# EAGLE design board_up (EAGLE 5.10)
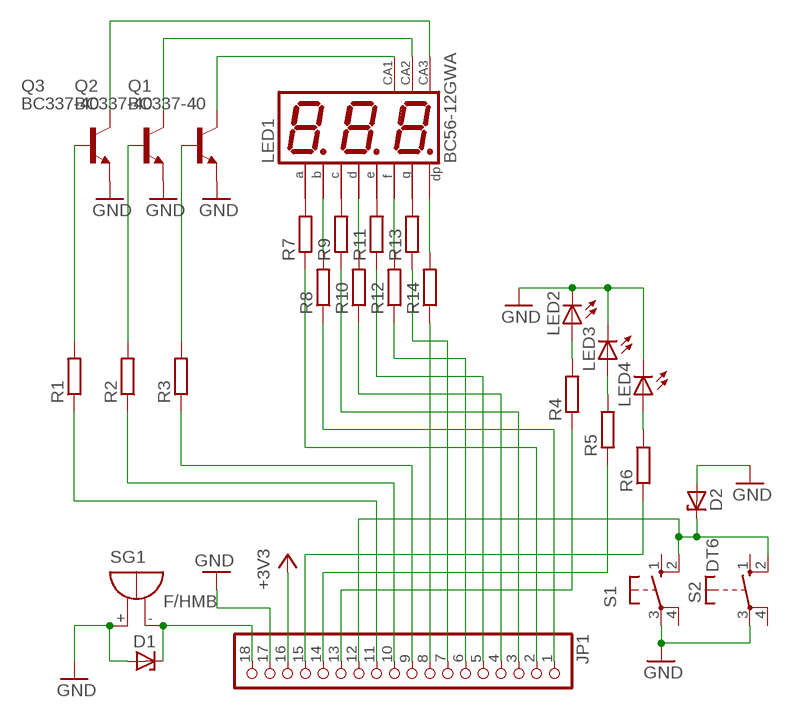
[diagram p0: schematic, sheet 1]

## Parts
D1  ZENER-DIODESMB  [SMB]
D2  ZENER-DIODESMB  [SMB]
JP1  PINHD-1X18  [1X18]
LED1  BC56-12GWA  [BX56-12]
LED2  LED3MM  [LED3MM]
LED3  LED3MM  [LED3MM]
LED4  LED3MM  [LED3MM]
Q1  BC337-40  [TO92]
Q2  BC337-40  [TO92]
Q3  BC337-40  [TO92]
R1  R-EU_R0805  [R0805]
R2  R-EU_R0805  [R0805]
R3  R-EU_R0805  [R0805]
R4  R-EU_R0805  [R0805]
R5  R-EU_R0805  [R0805]
R6  R-EU_R0805  [R0805]
R7  R-EU_R0805  [R0805]
R8  R-EU_R0805  [R0805]
R9  R-EU_R0805  [R0805]
R10  R-EU_R0805  [R0805]
R11  R-EU_R0805  [R0805]
R12  R-EU_R0805  [R0805]
R13  R-EU_R0805  [R0805]
R14  R-EU_R0805  [R0805]
S1  10-XX  [B3F-10XX]
S2  DT6  [DT6]
SG1  F/HMB  [F/HMB]

## Nets
+3V3: JP1.16
GND: D1.A D2.A JP1.17 LED2.K(C) LED3.K(C) LED4.K(C) Q1.1(E) Q2.1(E) Q3.1(E) S1.3(P) S2.3(P) SG1.+
N$1: Q2.2(B) R2.2
N$2: Q1.2(B) R3.2
N$3: Q3.2(B) R1.2
N$4: LED1.12(CA) Q1.3(C)
N$5: LED1.9(CA) Q2.3(C)
N$6: LED1.8(CA) Q3.3(C)
N$7: JP1.2 R7.1
N$8: JP1.1 R8.1
N$9: JP1.3 R9.1
N$10: JP1.4 R10.1
N$11: JP1.5 R11.1
N$12: JP1.6 R12.1
N$13: JP1.7 R13.1
N$14: LED1.11(A) R7.2
N$15: JP1.9 R3.1
N$16: JP1.10 R2.1
N$17: JP1.11 R1.1
N$18: D1.C JP1.18 SG1.-
N$19: D2.C JP1.12 S1.2(S1) S2.2(S)
N$20: LED1.7(B) R8.2
N$21: LED2.A R4.2
N$22: LED3.A R5.2
N$23: LED4.A R6.2
N$24: LED1.4(C) R9.2
N$25: JP1.13 R4.1
N$26: JP1.14 R5.1
N$27: JP1.15 R6.1
N$28: LED1.2(D) R10.2
N$29: LED1.1(E) R11.2
N$30: LED1.10(F) R12.2
N$31: LED1.5(G) R13.2
N$32: LED1.3(DP) R14.2
N$33: JP1.8 R14.1
Unconnected: S1.1(S) S1.4(P1) S2.1(S) S2.4(P)

## Library data of the parts
D1 D2 = diode:ZENER-DIODE: Z-Diode
JP1 = pinhead:PINHD-1X18: PIN HEADER
LED1 = display-kingbright:B?56-12*WA: 14.22mm (0.56INCH) THREE DIGIT NUMERIC DISPLAY Source: http://www.kingbright.com .. BA56-11EWA(Ver1189474895.pdf
LED2-LED4 = led:LED: LED OSRAM: - CHIPLED LG R971, LG N971, LY N971, LG Q971, LY Q971, LO R971, LY R971 LH N974, LH R974 LS Q976, LO Q976, LY Q976 LO Q996 - Hyper CHIPLED LW Q18S LB Q993, LB Q99A, LB R99A - SideLED LS A670, LO A670, LY A670, LG A670, LP A670 LB A673, LV A673, LT A673, LW A673 LH A674 LY A675 LS A676, LA A676, LO A676, LY A676, LW A676 LS A679, LY A679, LG A679 - Hyper Micro SIDELED® LS Y876, LA Y876, LO Y876, LY Y876 LT Y87S - SmartLED LW L88C, LW L88S LB L89C, LB L89S, LG L890 LS L89K, LO L89K, LY L89K LS L896, LA L896, LO L896, LY L896 - TOPLED LS T670, LO T670, LY T670, LG T670, LP T670 LSG T670, LSP T670, LSY T670, LOP T670, LYG T670 LG T671, LOG T671, LSG T671 LB T673, LV T673, LT T673, LW T673 LH T674 LS T676, LA T676, LO T676, LY T676, LB T676, LH T676, LSB T676, LW T676 LB T67C, LV T67C, LT T67C, LS T67K, LO T67K, LY T67K, LW E67C LS E67B, LA E67B, LO E67B, LY E67B, LB E67C, LV E67C, LT E67C LW T67C LS T679, LY T679, LG T679 LS T770, LO T770, LY T770, LG T770, LP T770 LB T773, LV T773, LT T773, LW T773 LH T774 LS E675, LA E675, LY E675, LS T675 LS T776, LA T776, LO T776, LY T776, LB T776 LHGB T686 LT T68C, LB T68C - Hyper Mini TOPLED® LB M676 - Mini TOPLED Santana® LG M470 LS M47K, LO M47K, LY M47K Source: http://www.osram.convergy.de LUXEON: - LUMILED® LXK2-PW12-R00, LXK2-PW12-S00, LXK2-PW14-U00, LXK2-PW14-V00 LXK2-PM12-R00, LXK2-PM12-S00, LXK2-PM14-U00 LXK2-PE12-Q00, LXK2-PE12-R00, LXK2-PE12-S00, LXK2-PE14-T00, LXK2-PE14-U00 LXK2-PB12-K00, LXK2-PB12-L00, LXK2-PB12-M00, LXK2-PB14-N00, LXK2-PB14-P00, LXK2-PB14-Q00 LXK2-PR12-L00, LXK2-PR12-M00, LXK2-PR14-Q00, LXK2-PR14-R00 LXK2-PD12-Q00, LXK2-PD12-R00, LXK2-PD12-S00 LXK2-PH12-R00, LXK2-PH12-S00 LXK2-PL12-P00, LXK2-PL12-Q00, LXK2-PL12-R00 Source: www.luxeon.com KINGBRIGHT: KA-3528ASYC Source: www.kingbright.com
Q1-Q3 = transistor-npn:BC337*: NPN Transistor
R1-R14 = rcl:R-EU_: RESISTOR, European symbol
S1 = switch-omron:10-XX: OMRON SWITCH
S2 = switch-misc:DT: ITT SWITCH
SG1 = buzzer:F/HMB: BUZZER Source: Buerklin

## Board
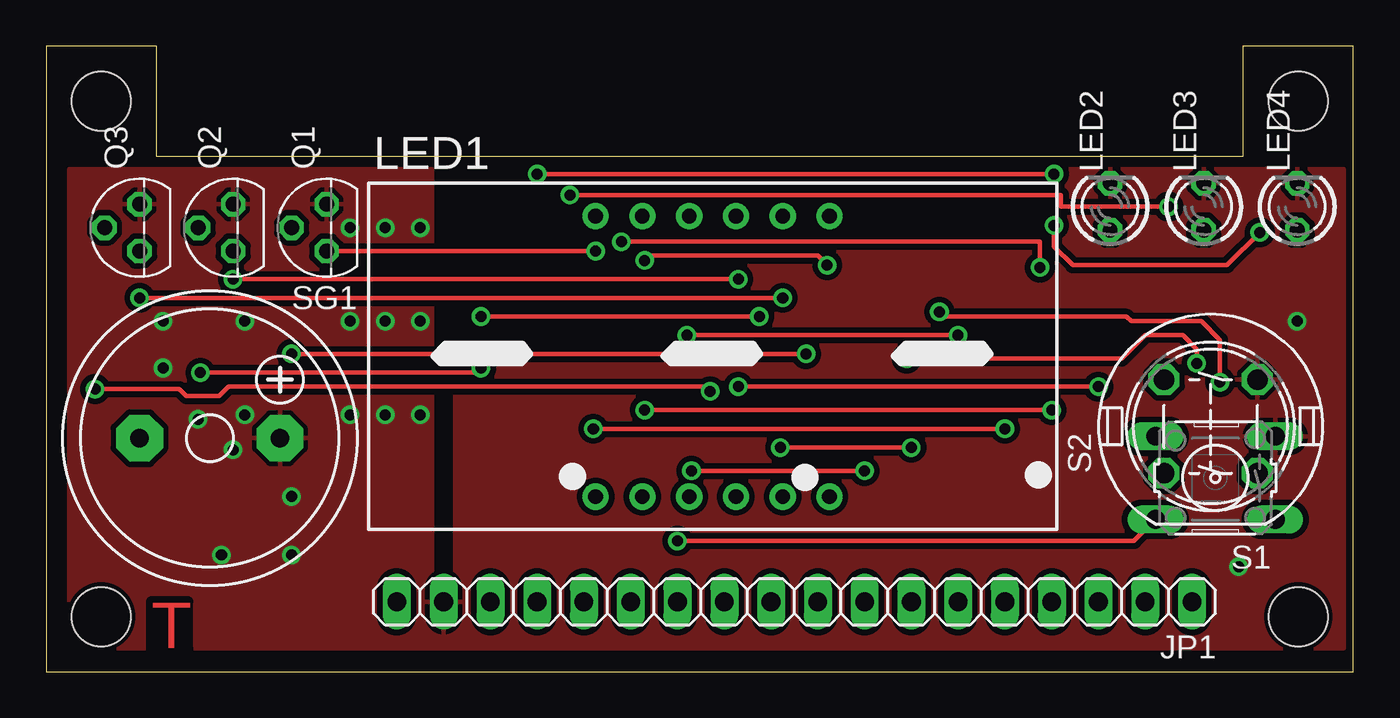
[diagram p1: board, top side]
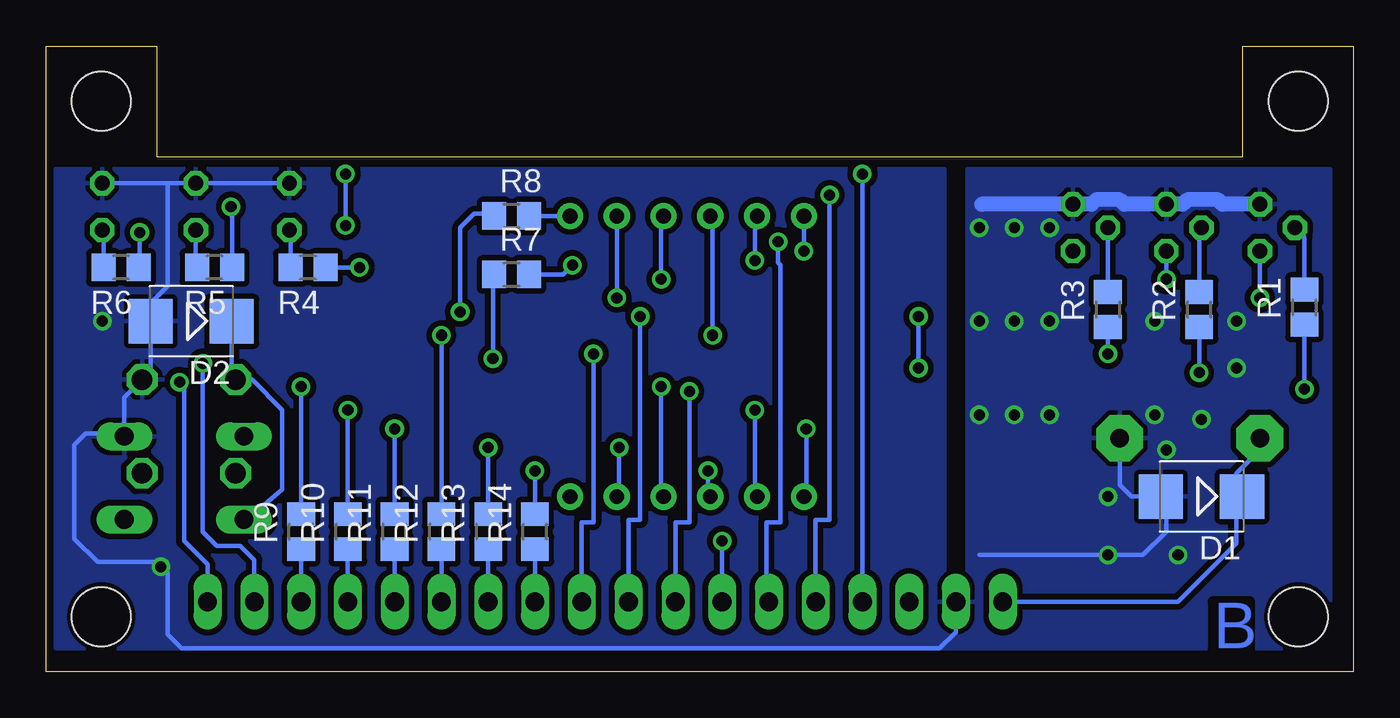
[diagram p2: board, bottom side, seen from below]

Size 71 x 34 mm. Coordinates in mm from the lower left corner, seen from the top.
Outline: 0,0 71,0 71,34 65,34 65,28 6,28 6,34 0,34 0,0
Copper layers (1*16): Top 0.035mm / dielectric 1.5mm / Bottom 0.035mm
Design rules "default *": minimum track width 8mil, minimum drill 23mil, track to track 12mil, track to pad 12mil, pad to pad 12mil, via to via 12mil, smd to smd 8mil, copper to edge 10mil, drill to drill 8mil, minimum pad ring 10mil, minimum via ring 8mil, stop-mask expansion 4mil, vias tented up to drill 0mil, thermal gap 10mil
Holes 3.2 mm at 3,3 68,3 3,31 68,31

### Footprints (pad centres in the part's own frame; a part is rotated, then mirrored left to right if it is on the bottom)
SMB = smd 2.4 x 2.4: A 2.2,0; C -2.2,0
1X18 = drill 1.016 long: 1 -21.59,0; 2 -19.05,0; 3 -16.51,0; 4 -13.97,0; 5 -11.43,0; 6 -8.89,0; 7 -6.35,0; 8 -3.81,0; 9 -1.27,0; 10 1.27,0; 11 3.81,0; 12 6.35,0; 13 8.89,0; 14 11.43,0; 15 13.97,0; 16 16.51,0; 17 19.05,0; 18 21.59,0
BX56-12 = drill 0.8 pad 1.422 round: 1 -6.35,-7.62; 2 -3.81,-7.62; 3 -1.27,-7.62; 4 1.27,-7.62; 5 3.81,-7.62; 6 6.35,-7.62; 7 6.35,7.62; 8 3.81,7.62; 9 1.27,7.62; 10 -1.27,7.62; 11 -3.81,7.62; 12 -6.35,7.62
LED3MM = drill 0.813 octagon: A -1.27,0; K 1.27,0
TO92 = drill 0.813 octagon: 1 1.27,0; 2 0,1.905; 3 -1.27,0
R0805 = smd 1.3 x 1.5: 1 -0.95,0; 2 0.95,0
B3F-10XX = drill 1.016 long: 1 -3.251,2.261; 2 3.251,2.261; 3 -3.251,-2.261; 4 3.251,-2.261
DT6 = drill 1.118 octagon: 1 -2.54,2.54; 2 2.54,2.54; 3 2.54,-2.54; 4 -2.54,-2.54
F/HMB = drill 1.016 pad 2.54 octagon: + 3.81,0; - -3.81,0

### Placement (x,y rotation side)
D1  8.26,9.53 180 bottom
D2  63.12,19.05 180 bottom
JP1  40.64,3.81 180 top
LED1  36.2,17.14 0 top
LED2  57.78,25.27 90 top
LED3  62.87,25.27 90 top
LED4  67.94,25.27 90 top
Q1  15.24,24.13 90 top
Q2  10.16,24.13 90 top
Q3  5.08,24.13 90 top
R1  2.67,19.81 90 bottom
R2  8.38,19.68 90 bottom
R3  13.34,19.68 90 bottom
R4  56.77,21.97 180 bottom
R5  61.85,21.97 180 bottom
R6  66.93,21.97 180 bottom
R7  45.72,21.59 0 bottom
R8  45.72,24.77 0 bottom
R9  57.15,7.62 90 bottom
R10  54.61,7.62 90 bottom
R11  52.07,7.62 90 bottom
R12  49.53,7.62 90 bottom
R13  46.99,7.62 90 bottom
R14  44.45,7.62 90 bottom
S1  63.5,10.54 180 top
S2  63.25,13.34 90 top
SG1  8.89,12.7 0 top

### Tracks (layer width: path | path; a pad name or v marks a point on that pad's centre or on a via)
GND  (via drill 0.6)
  Bottom 0.254: SG1.+ 12.7,10.16 12.06,9.53 D1.A 10.16,9.23 10.16,7.62 11.43,6.35 20.32,6.35 | 21.59,5.08 JP1.17 21.59,2.16 22.48,1.27 63.63,1.27 64.39,2.03 64.39,5.46 64.9,5.97 68.2,5.97 69.47,7.24 69.47,12.32 68.83,12.95 66.9,12.95 S1.3 66.75,14.91 S2.3 65.32,16.34 D2.A 65.32,20.02 64.39,20.95 64.39,26.54 | LED2.K LED3.K 64.39,26.54 | 64.39,26.54 LED4.K
  Bottom 0.813: 20.19,25.4 Q1.1 14.22,25.4 13.97,25.65 12.7,25.65 12.45,25.4 Q2.1 9.27,25.4 9.02,25.65 7.37,25.65 7.11,25.4 Q3.1
  other vias: 20.32,19.05 18.41,19.05 16.51,19.05 16.51,13.97 18.41,13.97 20.32,13.97 18.41,24.13 20.32,24.13 16.51,24.13 9.53,6.35 13.34,6.35 13.34,9.53 67.94,19.05 64.77,5.71 10.79,19.05 6.35,19.05 6.35,16.51 8.26,13.72 10.79,13.97 10.16,12.06
  pour Bottom: 1.27,1.27 1.27,27.3 20.95,27.3 20.95,3.81 22.23,3.81 22.23,26.67 22.23,27.3 70.48,27.3 70.48,1.27
  pour Top: 1.27,27.3 1.27,1.27 70.48,1.27 70.48,27.3 22.23,27.3 22.23,3.81 20.95,3.81 20.95,27.3
N$1
  Bottom 0.254: R2.2 8.38,24 Q2.2
N$2
  Bottom 0.254: R3.2 Q1.2
N$3
  Bottom 0.254: R1.2 2.67,23.62 Q3.2
N$4  (via drill 0.6)
  Top 0.254: Q1.3 v29.84,22.86
  Bottom 0.254: v29.84,22.86 LED1.12
N$5  (via drill 0.6)
  Top 0.254: v10.16,21.34 v37.59,21.34
  Bottom 0.254: v10.16,21.34 Q2.3 | v37.59,21.34 37.59,24.64 LED1.9
N$6  (via drill 0.6)
  Top 0.254: v5.08,20.32 v40.01,20.32
  Bottom 0.254: v5.08,20.32 Q3.3 | v40.01,20.32 LED1.8
N$7  (via drill 0.6)
  Top 0.254: v62.48,16.76 62.48,17.53 61.72,18.29 59.69,18.29 58.42,17.02 v46.74,17.02
  Bottom 0.254: JP1.2 59.69,6.1 60.45,6.86 61.72,6.86 62.48,7.62 v62.48,16.76 | v46.74,17.02 46.74,21.52 R7.1
N$8  (via drill 0.6)
  Top 0.254: v63.75,15.75 63.75,18.03 62.74,19.05 58.93,19.05 58.67,19.3 48.77,19.3 v48.51,19.56
  Bottom 0.254: JP1.1 62.23,5.84 63.5,7.11 63.5,15.49 v63.75,15.75 | v48.51,19.56 48.51,24.13 47.75,24.89 46.8,24.89 R8.1
N$9
  Bottom 0.254: JP1.3 R9.1
N$10
  Bottom 0.254: JP1.4 R10.1
N$11
  Bottom 0.254: JP1.5 R11.1
N$12
  Bottom 0.254: JP1.6 R12.1
N$13
  Bottom 0.254: JP1.7 R13.1
N$14  (via drill 0.6)
  Top 0.254: v42.42,22.1 41.91,22.61 32.77,22.61 v32.51,22.35
  Bottom 0.254: R7.2 42.93,21.59 v42.42,22.1 | v32.51,22.35 32.51,24.64 LED1.11
N$15  (via drill 0.6)
  Top 0.254: v13.34,17.27 22.61,17.27 22.86,17.53 24.64,17.53 24.89,17.27 v41.27,17.27
  Bottom 0.254: JP1.9 41.91,8.13 41.27,8.13 v41.27,17.27 | v13.34,17.27 R3.1
N$16  (via drill 0.6)
  Top 0.254: v23.62,19.3 v38.73,19.3 | v8.38,16.26 23.37,16.26 v23.62,16.51
  Bottom 0.254: JP1.10 39.37,8.26 38.73,8.26 v38.73,19.3 | v8.38,16.26 R2.1 | v23.62,16.51 v23.62,19.3
N$17  (via drill 0.6)
  Top 0.254: v36.07,15.24 35.81,15.49 9.91,15.49 9.4,14.99 7.62,14.99 7.24,15.37 v2.67,15.37
  Bottom 0.254: JP1.11 36.83,8.13 36.07,8.13 v36.07,15.24 | v2.67,15.37 R1.1
N$18
  Bottom 0.254: JP1.18 9.53,3.81 6.35,6.99 6.35,9.23 D1.C 6.35,9.82 6.35,10.79 5.08,12.06 SG1.-
N$19  (via drill 0.6)
  Top 0.254: v34.29,7.11 59.08,7.11 S1.2
  Bottom 0.254: D2.C 60.92,16.09 S2.2 59.82,15.88 58.17,14.22 58.17,9.91 59.94,8.38 60.15,8.38 S1.2 | JP1.12 v34.29,7.11
N$20
  Bottom 0.254: LED1.7 R8.2
N$21
  Bottom 0.254: LED2.A 57.72,24 R4.2
N$22
  Bottom 0.254: LED3.A 62.87,22.04 R5.2
N$23
  Bottom 0.254: R6.2 67.88,23.94 LED4.A
N$24  (via drill 0.6)
  Top 0.254: v37.59,15.49 v57.15,15.49
  Bottom 0.254: v57.15,15.49 R9.2 | v37.59,15.49 37.59,9.65 LED1.4
N$25  (via drill 0.6)
  Top 0.254: v31.24,23.37 53.98,23.37 v53.98,21.97
  Bottom 0.254: JP1.13 31.88,3.81 31.88,8.13 31.11,8.13 31.11,22.1 31.24,22.23 v31.24,23.37 | v53.98,21.97 R4.1
N$26  (via drill 0.6)
  Top 0.254: v28.45,25.91 55.12,25.91 55.12,25.27 v60.96,25.27
  Bottom 0.254: JP1.14 29.21,8.26 28.45,8.26 v28.45,25.91 | v60.96,25.27 60.9,25.27 R5.1
N$27  (via drill 0.6)
  Top 0.254: v26.67,27.05 v54.74,27.05 | v54.74,24.26 54.74,23.11 55.75,22.1 64.14,22.1 v65.91,23.88
  Bottom 0.254: JP1.15 v26.67,27.05 | v54.74,27.05 v54.74,24.26 | v65.91,23.88 65.91,22.04 R6.1
N$28  (via drill 0.6)
  Top 0.254: v32.51,14.22 v54.61,14.22
  Bottom 0.254: v54.61,14.22 R10.2 | v32.51,14.22 32.51,9.65 LED1.2
N$29  (via drill 0.6)
  Top 0.254: v29.72,13.21 v52.07,13.21
  Bottom 0.254: v52.07,13.21 R11.2 | v29.72,13.21 29.72,9.65 LED1.1
N$30  (via drill 0.6)
  Top 0.254: v34.8,18.29 v49.53,18.29
  Bottom 0.254: v49.53,18.29 R12.2 | v34.8,18.29 34.8,24.64 LED1.10
N$31  (via drill 0.6)
  Top 0.254: v39.88,12.19 v46.99,12.19
  Bottom 0.254: v46.99,12.19 R13.2 | v39.88,12.19 39.88,9.65 LED1.5
N$32  (via drill 0.6)
  Top 0.254: v35.05,10.92 v44.45,10.92
  Bottom 0.254: v44.45,10.92 R14.2 | v35.05,10.92 35.05,9.65 LED1.3
N$33
  Bottom 0.254: JP1.8 R14.1

### Text on the board
Top: T
Bottom: B